# EasyEDA Pro project ProProject_keyboard_Tassel43_2024-03-30.epro, board Tassel43_Without_RGB
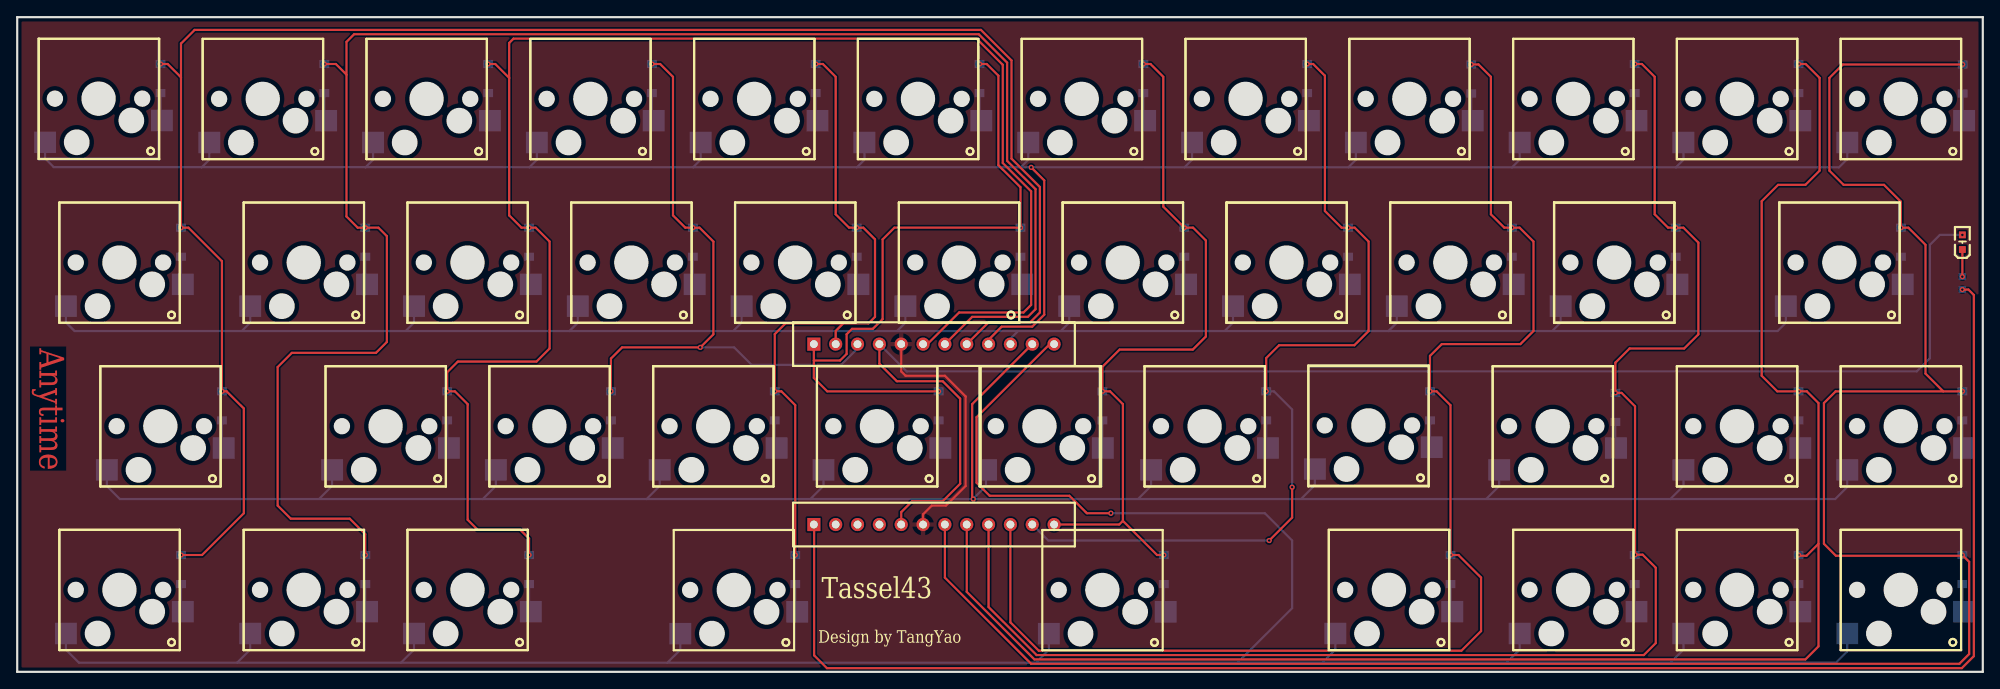
[diagram p3: board, top side]
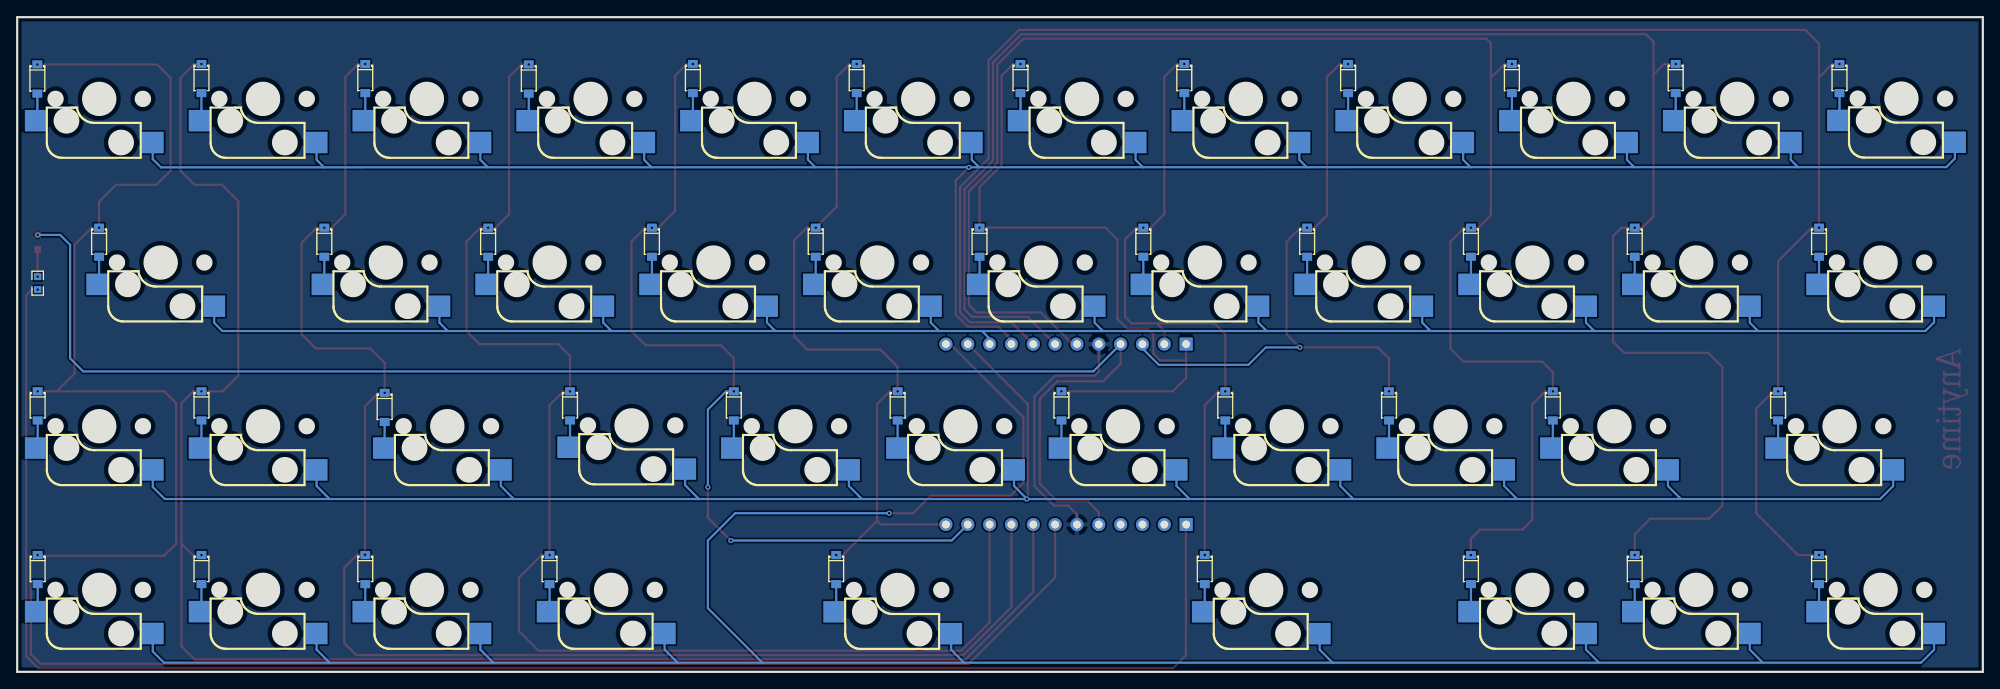
[diagram p4: board, bottom side, seen from below]

Outline 228.6 x 76.2 mm; copper layers: Top Layer, Bottom Layer. Coordinates in mm from the lower left corner of the outline.
Outline path: 0,76.2 228.6,76.2 228.6,0 0,0 0,76.2
Stack: Top Layer 0.035mm / Dielectric1 1.51mm FR4 er 4.5 / Bottom Layer 0.035mm

## Design rules (mm)
spacing Default (default): track to track 0.152, other pairs 0 to 0.152
track width Default (default): min 0.254, default 0.254, max 25.4
differential pair differentialPair (default): width min 0.127, default 0.254, max 2.54; gap min 0.152, default 0.152
via Default (default): diameter min 0.61, default 0.61, max 100.025; hole min 0.305, default 0.305, max 59.995
net GND uses gge53323
pour e199 uses gge53329
pour e490 uses gge53323

## Placement (name value [footprint] x y rotation side)
A  -  [凯华热插拨]  33.32 47.64 0 top
B  -  [凯华热插拨]  118.89 28.59 0 top
BACKSPACE  -  [凯华热插拨]  219.06 66.69 0 top
C  -  [凯华热插拨]  80.95 28.59 0 top
CAP  -  [凯华热插拨]  16.65 28.59 0 top
D  -  [凯华热插拨]  71.42 47.64 0 top
D14  1N4148W  [SOD-123_L2.8-W1.8-LS3.7-RD]  19.05 11.91 270 bottom
D35  1N4148W  [SOD-123_L2.8-W1.8-LS3.7-RD]  40.48 11.91 270 bottom
D41  1N4148W  [SOD-123_L2.8-W1.8-LS3.7-RD]  59.53 11.91 270 bottom
D43  1N4148W  [SOD-123_L2.8-W1.8-LS3.7-RD]  90.49 11.91 270 bottom
D45  1N4148W  [SOD-123_L2.8-W1.8-LS3.7-RD]  133.35 11.91 270 bottom
D49  1N4148W  [SOD-123_L2.8-W1.8-LS3.7-RD]  166.69 11.91 270 bottom
D50  1N4148W  [SOD-123_L2.8-W1.8-LS3.7-RD]  188.12 11.91 270 bottom
D51  1N4148W  [SOD-123_L2.8-W1.8-LS3.7-RD]  207.17 11.91 270 bottom
D52  1N4148W  [SOD-123_L2.8-W1.8-LS3.7-RD]  226.22 11.91 270 bottom
D53  1N4148W  [SOD-123_L2.8-W1.8-LS3.7-RD]  23.81 30.96 270 bottom
D54  1N4148W  [SOD-123_L2.8-W1.8-LS3.7-RD]  50 30.96 270 bottom
D55  1N4148W  [SOD-123_L2.8-W1.8-LS3.7-RD]  69.05 30.96 270 bottom
D56  1N4148W  [SOD-123_L2.8-W1.8-LS3.7-RD]  88.11 30.96 270 bottom
D57  1N4148W  [SOD-123_L2.8-W1.8-LS3.7-RD]  107.16 30.96 270 bottom
D58  1N4148W  [SOD-123_L2.8-W1.8-LS3.7-RD]  126.21 30.96 270 bottom
D59  1N4148W  [SOD-123_L2.8-W1.8-LS3.7-RD]  145.26 30.96 270 bottom
D60  1N4148W  [SOD-123_L2.8-W1.8-LS3.7-RD]  164.31 30.96 270 bottom
D61  1N4148W  [SOD-123_L2.8-W1.8-LS3.7-RD]  185.87 30.78 270 bottom
D62  1N4148W  [SOD-123_L2.8-W1.8-LS3.7-RD]  207.17 30.96 270 bottom
D63  1N4148W  [SOD-123_L2.8-W1.8-LS3.7-RD]  226.22 30.96 270 bottom
D64  1N4148W  [SOD-123_L2.8-W1.8-LS3.7-RD]  19.05 50.01 270 bottom
D65  1N4148W  [SOD-123_L2.8-W1.8-LS3.7-RD]  40.48 50.01 270 bottom
D66  1N4148W  [SOD-123_L2.8-W1.8-LS3.7-RD]  59.53 50.01 270 bottom
D68  1N4148W  [SOD-123_L2.8-W1.8-LS3.7-RD]  78.58 50.01 270 bottom
D69  1N4148W  [SOD-123_L2.8-W1.8-LS3.7-RD]  97.63 50.01 270 bottom
D70  1N4148W  [SOD-123_L2.8-W1.8-LS3.7-RD]  116.68 50.01 270 bottom
D71  1N4148W  [SOD-123_L2.8-W1.8-LS3.7-RD]  135.73 50.01 270 bottom
D72  1N4148W  [SOD-123_L2.8-W1.8-LS3.7-RD]  154.78 50.01 270 bottom
D73  1N4148W  [SOD-123_L2.8-W1.8-LS3.7-RD]  173.83 50.01 270 bottom
D74  1N4148W  [SOD-123_L2.8-W1.8-LS3.7-RD]  192.88 50.01 270 bottom
D75  1N4148W  [SOD-123_L2.8-W1.8-LS3.7-RD]  219.08 50.01 270 bottom
D76  1N4148W  [SOD-123_L2.8-W1.8-LS3.7-RD]  226.25 69.01 270 bottom
D77  1N4148W  [SOD-123_L2.8-W1.8-LS3.7-RD]  207.17 69.06 270 bottom
D78  1N4148W  [SOD-123_L2.8-W1.8-LS3.7-RD]  188.12 69.06 270 bottom
D79  1N4148W  [SOD-123_L2.8-W1.8-LS3.7-RD]  169.1 69.01 270 bottom
D80  1N4148W  [SOD-123_L2.8-W1.8-LS3.7-RD]  150.02 69.06 270 bottom
D81  1N4148W  [SOD-123_L2.8-W1.8-LS3.7-RD]  130.97 69.06 270 bottom
D82  1N4148W  [SOD-123_L2.8-W1.8-LS3.7-RD]  111.92 69.06 270 bottom
D83  1N4148W  [SOD-123_L2.8-W1.8-LS3.7-RD]  92.87 69.06 270 bottom
D84  1N4148W  [SOD-123_L2.8-W1.8-LS3.7-RD]  73.82 69.06 270 bottom
D85  1N4148W  [SOD-123_L2.8-W1.8-LS3.7-RD]  54.77 69.06 270 bottom
D86  1N4148W  [SOD-123_L2.8-W1.8-LS3.7-RD]  35.72 69.06 270 bottom
D87  1N4148W  [SOD-123_L2.8-W1.8-LS3.7-RD]  16.67 69.06 270 bottom
DEL  -  [凯华热插拨]  219.06 28.59 0 top
E  -  [凯华热插拨]  66.66 66.69 0 top
ENTER  -  [凯华热插拨]  211.91 47.64 0 top
ESC  -  [凯华热插拨]  9.47 66.72 0 top
F  -  [凯华热插拨]  90.47 47.64 0 top
G  -  [凯华热插拨]  109.52 47.64 0 top
H  -  [凯华热插拨]  128.57 47.64 0 top
I  -  [凯华热插拨]  161.91 66.69 0 top
J  -  [凯华热插拨]  147.62 47.64 0 top
K  -  [凯华热插拨]  166.67 47.64 0 top
L  -  [凯华热插拨]  185.72 47.64 0 top
LCTRL  -  [凯华热插拨]  11.89 9.54 0 top
LED1  TJ-S1608SW6TGLC2R-A5  [LED0603-R-RD_RED]  226.22 50.01 90 top
LGUI  -  [凯华热插拨]  33.32 9.54 0 top
LGUI1  -  [凯华热插拨]  52.37 9.54 0 top
LGUI2  -  [凯华热插拨]  159.53 9.54 0 top
LGUI3  -  [凯华热插拨]  180.96 9.54 0 top
LGUI4  -  [凯华热插拨]  200.01 9.54 0 top
LGUI5  -  [凯华热插拨]  219.06 9.54 0 top
LGUI6  -  [凯华热插拨]  83.34 9.52 0 top
LGUI7  -  [凯华热插拨]  126.21 9.52 0 top
M  -  [凯华热插拨]  157.15 28.68 0 top
N  -  [凯华热插拨]  138.1 28.59 0 top
O  -  [凯华热插拨]  180.96 66.69 0 top
P  -  [凯华热插拨]  200.01 66.69 0 top
Q  -  [凯华热插拨]  28.56 66.69 0 top
R  -  [凯华热插拨]  85.71 66.69 0 top
R7  1kΩ  [R0603]  226.22 45.24 90 bottom
S  -  [凯华热插拨]  52.37 47.64 0 top
T  -  [凯华热插拨]  104.76 66.69 0 top
TAB  -  [凯华热插拨]  11.89 47.64 0 top
TO  -  [凯华热插拨]  178.58 28.59 0 top
U  -  [凯华热插拨]  142.86 66.69 0 top
U5  -  [1X12排针]  95.19 14.6 90 top
U6  -  [1X12排针]  95.19 35.6 90 top
UP  -  [凯华热插拨]  200.01 28.59 0 top
V  -  [凯华热插拨]  100 28.59 0 top
W  -  [凯华热插拨]  47.61 66.69 0 top
X  -  [凯华热插拨]  61.9 28.59 0 top
Y  -  [凯华热插拨]  123.81 66.69 0 top
Z  -  [凯华热插拨]  42.85 28.59 0 top

## Footprints (pads in the part's own frame, mm; a bottom-side part is the same pattern mirrored in y, then rotated)
1X12排针
  rect 1.524x1.524 hole 0.914: 1(2.54,2.54)
  round 1.524 hole 0.914: 2(2.541,0) 3(2.541,-2.54) 4(2.541,-5.08) 5(2.541,-7.62) 6(2.541,-10.16) 7(2.541,-12.7) 8(2.541,-15.24) 9(2.541,-17.78) 10(2.541,-20.32) 11(2.541,-22.86) 12(2.541,-25.4)
LED0603-R-RD_RED
  rect 0.8x0.8 smd: 1(0.851,0) 2(-0.851,0)
R0603
  rect 0.806x0.864 smd: 1(-0.753,0) 2(0.753,0)
SOD-123_L2.8-W1.8-LS3.7-RD
  rect 0.95x1.15 smd: 1(-1.692,0) 2(1.692,0)
凯华热插拨
  rect 2.55x2.5 smd far side: K1(-6.223,-5.08) K2(7.366,-2.54)

## Nets
GND: U5.6 U6.5
V1_4: D57.2 V.K2
VCC: LED1.1 U5.5 U6.4
A1_4: A.K2 D65.2
B1_4: B.K2 D58.2
C9_4: C.K2 D56.2
CAPLED: R7.1 U5.1
CAPS1_4: D49.2 LGUI2.K2
COL0: D14.1 D53.1 D64.1 D87.1 U6.8
COL1: D35.1 D65.1 D86.1 U6.7
COL2: D41.1 D54.1 D66.1 D85.1 U6.6
COL3: D55.1 D68.1 D84.1 U6.3
COL4: D43.1 D56.1 D69.1 D83.1 U6.2
COL5: D57.1 D70.1 D82.1 U6.1
COL6: D45.1 D58.1 D71.1 D81.1 U5.12
COL7: D59.1 D72.1 D80.1 U5.11
COL8: D49.1 D60.1 D73.1 D79.1 U5.10
COL9: D50.1 D61.1 D74.1 D78.1 U5.9
COL10: D51.1 D62.1 D77.1 U5.8
COL11: D52.1 D63.1 D75.1 D76.1 U5.7
D14_2: D14.2 LCTRL.K2
D53_2: CAP.K2 D53.2
D64_2: D64.2 TAB.K2
D67_4: D.K2 D68.2
D76_2: BACKSPACE.K2 D76.2
D77_2: D77.2 P.K2
D78_2: D78.2 O.K2
D79_2: D79.2 I.K2
D80_2: D80.2 U.K2
D81_2: D81.2 Y.K2
D82_2: D82.2 T.K2
D83_2: D83.2 R.K2
D84_2: D84.2 E.K2
D85_2: D85.2 W.K2
D86_2: D86.2 Q.K2
D+: U5.3
D-: U5.2
DEL1_4: D63.2 DEL.K2
DOWN1_4: D51.2 LGUI4.K2
ENTER1_4: D75.2 ENTER.K2
ESC1_4: D87.2 ESC.K2
F1_4: D69.2 F.K2
G1_4: D70.2 G.K2
H1_4: D71.2 H.K2
J2_4: D72.2 J.K2
K1_4: D73.2 K.K2
L1_4: D74.2 L.K2
LALT1_4: D41.2 LGUI1.K2
LEFT1_4: D50.2 LGUI3.K2
LGUI1_4: D35.2 LGUI.K2
M1_4: D60.2 M.K2
N1_4: D59.2 N.K2
R7_2: LED1.2 R7.2
RGB: U5.4
RIGHT1_4: D52.2 LGUI5.K2
ROW0: BACKSPACE.K1 E.K1 ESC.K1 I.K1 O.K1 P.K1 Q.K1 R.K1 T.K1 U.K1 U6.9 W.K1 Y.K1
ROW1: A.K1 D.K1 ENTER.K1 F.K1 G.K1 H.K1 J.K1 K.K1 L.K1 S.K1 TAB.K1 U6.10
ROW2: B.K1 C.K1 CAP.K1 DEL.K1 M.K1 N.K1 TO.K1 U6.11 UP.K1 V.K1 X.K1 Z.K1
ROW3: LCTRL.K1 LGUI.K1 LGUI1.K1 LGUI2.K1 LGUI3.K1 LGUI4.K1 LGUI5.K1 LGUI6.K1 LGUI7.K1 U6.12
RSHIFT1_4: D45.2 LGUI7.K2
S1_4: D66.2 S.K2
SPACE1_4: D43.2 LGUI6.K2
TO1_4: D61.2 TO.K2
UP1_4: D62.2 UP.K2
X2_4: D55.2 X.K2
Z1_4: D54.2 Z.K2

## Via types
v1: diameter 0.61, hole 0.305, Top Layer to Bottom Layer, 52 vias

## Routing (per net, layer and track width the routed paths; a pad name or vN(x,y) marks a point on that pad's centre or on a via; arc(x,y) is an arc through that point)
GND: length 29.8
  Top Layer w0.254: 102.81,38.14 102.81,34.97 103.32,34.46 107.89,34.46 110.3,32.05 110.3,21.63 108.02,19.35 106.37,19.35 105.35,18.33 105.35,17.14
V1_4: length 3.3
  Bottom Layer w0.254: V.K2 107.16,26.26 D57.2
VCC: length 174.5
  Top Layer w0.254: 102.81,17.14 102.81,18.59 104.08,19.86 107.64,19.86 109.67,21.89 109.67,31.79 107.64,33.83 102.3,33.83 100.27,35.86 100.27,38.14
  Bottom Layer w0.254: v1(226.22,50.86) 223.6,50.86 222.44,49.7 222.44,36.49 220.92,34.97 103.45,34.97 100.27,38.14
A1_4: length 3.3
  Bottom Layer w0.254: A.K2 40.48,45.31 D65.2
B1_4: length 3.2
  Bottom Layer w0.254: D58.2 126.21,26.1 B.K2
C9_4: length 3.3
  Bottom Layer w0.254: D56.2 88.11,26.26 C.K2
CAPLED: length 194.9
  Top Layer w0.254: 226.22,44.49 226.92,44.49 227.56,43.86 227.56,1.82 226.16,0.43 94.17,0.43 92.68,1.92 92.68,17.15
  vias: v1(226.22,44.49)
CAPS1_4: length 3.3
  Bottom Layer w0.254: LGUI2.K2 166.69,7.21 D49.2
COL0: length 210.3
  Top Layer w0.254: 110.43,38.14 112.97,40.68 117.8,40.68 118.94,41.83 118.94,56.43 115.64,59.73 115.64,71.16 112.08,74.72 20.64,74.72 19.05,73.13 19.05,69.2 ; 19.05,69.2 17.5,70.75 16.67,70.75 ; 19.05,69.2 v1(19.05,51.7) 19.91,51.7 23.81,47.8 23.81,32.65 24.36,32.65 26.36,30.65 26.36,18.46 21.5,13.6 19.05,13.6
  vias: v1(16.67,70.75) v1(19.05,13.6) v1(23.81,32.65)
COL1: length 206.3
  Top Layer w0.254: U6.7 111.07,41.32 117.54,41.32 118.43,42.21 118.43,56.18 115.13,59.48 115.13,70.91 111.83,74.21 39.18,74.21 38.29,73.33 38.29,69.51 ; 38.29,69.51 38.29,53 39.6,51.7 v1(40.48,51.7) 42.01,51.7 42.99,50.72 42.99,38.4 41.72,37.13 31.94,37.13 30.29,35.48 30.29,19.35 31.82,17.82 38.68,17.82 40.48,16.02 v1(40.48,13.6) ; 38.29,69.51 37.06,70.75 35.72,70.75
  vias: v1(35.72,70.75)
COL2: length 185.9
  Top Layer w0.254: v1(59.53,51.7) 60.3,51.7 61.92,50.08 61.92,37.64 60.39,36.11 51.25,36.11 50,34.87 v1(50,32.65) 50.9,32.65 52.39,31.16 52.39,17.7 53.53,16.55 58.49,16.55 59.53,15.51 v1(59.53,13.6) ; 57.22,69.13 57.22,73.2 57.72,73.7 111.57,73.7 114.62,70.66 114.62,59.23 117.92,55.92 117.92,42.72 117.03,41.83 109.54,41.83 105.86,38.14 105.35,38.14 ; 57.22,69.13 55.6,70.75 54.77,70.75 ; 57.22,69.13 57.22,53.13 58.64,51.7 59.53,51.7
  vias: v1(54.77,70.75)
COL3: length 73.3
  Top Layer w0.254: 69.05,32.65 69.05,36.47 70.35,37.76 v1(79.44,37.76) 80.97,39.29 80.97,50.08 79.35,51.7 77.7,51.7 76.27,53.13 76.27,69.26 74.78,70.75 73.82,70.75
  Bottom Layer w0.254: 97.73,38.14 97.73,37.64 95.83,35.73 85.41,35.73 83.38,37.76 v1(79.44,37.76)
  vias: v1(69.05,32.65) v1(73.82,70.75) v1(78.58,51.7)
COL4: length 76.2
  Top Layer w0.254: 92.87,70.75 93.7,70.75 95.19,69.26 95.19,53.26 96.75,51.7 v1(97.63,51.7) 98.4,51.7 99.76,50.34 99.76,41.32 99,40.56 89.35,40.56 88.11,39.32 88.11,32.65 88.88,32.65 90.49,31.04 90.49,13.6 ; U6.2 95.19,39.68 96.07,40.56
  vias: v1(88.11,32.65) v1(90.49,13.6) v1(92.87,70.75)
COL5: length 77.8
  Top Layer w0.254: 111.92,70.75 112.75,70.75 114.11,69.39 114.11,58.97 116.68,56.4 116.68,51.7 102.02,51.7 100.65,50.34 100.65,41.07 99.51,39.92 97.1,39.92 96.46,39.29 96.46,37 95.7,36.24 92.65,36.24 ; 92.65,38.14 92.65,34.21 94.21,32.65 107.16,32.65
  vias: v1(107.16,32.65) v1(111.92,70.75) v1(116.68,51.7)
COL6: length 83.3
  Top Layer w0.254: U5.12 128.17,17.14 128.59,17.57 ; 128.59,17.57 128.59,31.16 127.1,32.65 126.21,32.65 126.21,35.51 128.21,37.51 136.72,37.51 138.24,39.03 138.24,50.21 136.75,51.7 v1(135.73,51.7) 133.29,54.14 133.29,69.26 131.8,70.75 v1(130.97,70.75) ; 128.59,17.57 132.56,13.6 133.35,13.6
  vias: v1(126.21,32.65) v1(133.35,13.6)
COL7: length 101
  Top Layer w0.254: v1(145.61,15.28) 148.28,17.95 v1(148.28,21.49) ; 145.26,32.65 145.26,36.52 146.75,38.02 155.52,38.02 157.17,39.67 157.17,50.08 155.55,51.7 v1(154.78,51.7) 154.02,51.7 152.09,53.64 152.09,69.39 150.72,70.75 150.02,70.75
  Bottom Layer w0.254: v1(145.61,15.28) 119.91,15.28 U5.11 ; v1(148.28,21.49) 148.28,30.52 146.15,32.65 145.26,32.65
  vias: v1(145.26,32.65) v1(150.02,70.75)
COL8: length 152.7
  Top Layer w0.254: 115.51,17.14 115.51,5.76 118.81,2.46 167.96,2.46 170.25,4.74 170.25,10.97 167.62,13.6 166.69,13.6 166.69,31.03 165.08,32.65 164.31,32.65 164.31,36.78 165.68,38.14 174.82,38.14 176.34,39.67 176.34,50.08 174.73,51.7 172.95,51.7 171.39,53.26 171.39,69.26 169.95,70.7 v1(169.1,70.7)
  vias: v1(164.31,32.65) v1(166.69,13.6) v1(173.83,51.7)
COL9: length 172.7
  Top Layer w0.254: 112.97,17.14 112.97,7.54 118.56,1.95 189.17,1.95 190.57,3.35 190.57,12.11 189.04,13.63 v1(188.15,13.63) 188.15,30.91 186.59,32.47 v1(185.87,32.47) ; 185.87,32.47 185.87,35.99 187.52,37.64 193.87,37.64 195.52,39.29 195.52,49.96 193.78,51.7 192,51.7 190.44,53.26 190.44,69.26 188.95,70.75 188.12,70.75
  vias: v1(188.12,70.75) v1(192.88,51.7)
COL10: length 192.4
  Top Layer w0.254: v1(207.17,13.6) 207.26,13.51 208.09,13.51 209.49,14.9 ; 209.49,14.9 209.49,31.29 208.13,32.65 v1(207.17,32.65) ; 209.49,14.9 209.49,2.97 207.97,1.44 118.3,1.44 110.43,9.31 110.43,17.14 ; 207.17,32.65 204.7,32.65 202.89,34.46 202.89,54.78 204.79,56.69 207.97,56.69 209.62,58.34 209.62,69.13 208,70.75 207.17,70.75
  vias: v1(207.17,70.75)
COL11: length 252.9
  Top Layer w0.254: v1(226.22,13.6) 226.13,13.51 211.52,13.51 210.13,14.9 210.13,31.29 211.49,32.65 224,32.65 ; 224,32.65 226.22,32.65 ; 224,32.65 221.94,34.72 221.94,49.7 219.94,51.7 v1(219.08,51.7) 219.08,54.72 217.11,56.69 212.41,56.69 210.76,58.34 210.76,69.13 212.32,70.7 v1(226.25,70.7) ; 107.89,17.14 107.89,10.97 117.92,0.93 225.87,0.93 227.02,2.08 227.02,12.8 226.22,13.6
  vias: v1(226.22,32.65)
D14_2: length 3.3
  Bottom Layer w0.254: D14.2 19.05,7.21 LCTRL.K2
D53_2: length 3.3
  Bottom Layer w0.254: CAP.K2 23.81,26.26 D53.2
D64_2: length 3.3
  Bottom Layer w0.254: D64.2 19.05,45.31 TAB.K2
D67_4: length 3.3
  Bottom Layer w0.254: D.K2 78.58,45.31 D68.2
D76_2: length 3.2
  Bottom Layer w0.254: BACKSPACE.K2 226.25,64.32 D76.2
D77_2: length 3.3
  Bottom Layer w0.254: 207.38,64.15 207.17,64.36 D77.2
D78_2: length 3.3
  Bottom Layer w0.254: D78.2 188.12,64.36 O.K2
D79_2: length 3.2
  Bottom Layer w0.254: D79.2 169.1,64.32 I.K2
D80_2: length 3.3
  Bottom Layer w0.254: U.K2 150.02,64.36 D80.2
D81_2: length 3.3
  Bottom Layer w0.254: D81.2 130.97,64.36 Y.K2
D82_2: length 3.3
  Bottom Layer w0.254: T.K2 111.92,64.36 D82.2
D83_2: length 3.3
  Bottom Layer w0.254: D83.2 92.87,64.36 R.K2
D84_2: length 3.3
  Bottom Layer w0.254: E.K2 73.82,64.36 D84.2
D85_2: length 3.3
  Bottom Layer w0.254: W.K2 54.77,64.36 D85.2
D86_2: length 3.3
  Bottom Layer w0.254: D86.2 35.72,64.36 Q.K2
DEL1_4: length 3.3
  Bottom Layer w0.254: D63.2 226.22,26.25 DEL.K2
DOWN1_4: length 3.3
  Bottom Layer w0.254: D51.2 207.17,7.21 LGUI4.K2
ENTER1_4: length 3.3
  Bottom Layer w0.254: ENTER.K2 219.08,45.3 D75.2
ESC1_4: length 3.3
  Bottom Layer w0.254: D87.2 16.67,64.34 ESC.K2
F1_4: length 3.3
  Bottom Layer w0.254: F.K2 97.63,45.31 D69.2
G1_4: length 3.3
  Bottom Layer w0.254: G.K2 116.68,45.31 D70.2
H1_4: length 3.3
  Bottom Layer w0.254: H.K2 135.73,45.31 D71.2
J2_4: length 3.3
  Bottom Layer w0.254: J.K2 154.78,45.31 D72.2
K1_4: length 3.3
  Bottom Layer w0.254: K.K2 173.83,45.31 D73.2
L1_4: length 3.3
  Bottom Layer w0.254: L.K2 192.88,45.31 D74.2
LALT1_4: length 3.3
  Bottom Layer w0.254: LGUI1.K2 59.53,7.21 D41.2
LEFT1_4: length 3.3
  Bottom Layer w0.254: D50.2 188.12,7.21 LGUI3.K2
LGUI1_4: length 3.3
  Bottom Layer w0.254: D35.2 40.48,7.21 LGUI.K2
M1_4: length 3.2
  Bottom Layer w0.254: M.K2 164.31,26.35 D60.2
N1_4: length 3.3
  Bottom Layer w0.254: D59.2 145.26,26.26 N.K2
R7_2: length 3.2
  Top Layer w0.254: v1(226.22,46) 226.22,49.19
RIGHT1_4: length 3.3
  Bottom Layer w0.254: LGUI5.K2 226.22,7.21 D52.2
ROW0: length 272.7
  Top Layer w0.254: 112.97,38.14 112.97,38.65 114.49,40.18 118.05,40.18 119.45,41.57 119.45,57.19 v1(117.92,58.72)
  Bottom Layer w0.254: 97.66,58.72 98.53,59.6 T.K1 ; 212.84,59.68 211.88,58.72 4.25,58.75 3.24,59.75 ESC.K1 ; 212.84,59.68 BACKSPACE.K1 ; O.K1 174.74,59.6 173.86,58.72 ; Y.K1 117.59,59.6 116.71,58.72 ; R.K1 79.49,59.6 78.61,58.72 ; I.K1 155.69,59.6 154.81,58.72 ; U.K1 136.64,59.6 135.76,58.72 ; 192.91,58.72 193.79,59.6 P.K1 ; Q.K1 22.34,59.6 21.46,58.72 ; 59.56,58.72 60.44,59.6 E.K1 ; W.K1 41.39,59.6 40.51,58.72
ROW1: length 236.2
  Bottom Layer w0.254: F.K1 84.25,40.64 83.28,39.67 ; 122.35,42.56 122.35,40.64 121.38,39.67 ; D.K1 65.2,40.64 64.23,39.67 ; 45.18,39.67 46.15,40.64 S.K1 ; 178.53,39.67 179.5,40.64 L.K1 ; 116.4,39.67 115.51,38.78 U6.10 ; 159.48,39.67 160.45,40.64 K.K1 ; J.K1 141.4,40.64 140.43,39.67 ; A.K1 27.1,40.64 26.13,39.67 ; 102.33,39.67 103.3,40.64 G.K1 ; TAB.K1 5.67,40.67 6.67,39.67 204.73,39.67 205.69,40.63 ENTER.K1
ROW2: length 264.8
  Top Layer w0.254: v1(111.19,20.11) 111.07,20.24 111.07,31.16 118.05,38.14
  Bottom Layer w0.254: 54.15,20.11 55.67,21.63 55.67,23.51 ; 111.15,20.11 112.67,21.63 B.K1 ; 73.2,20.11 74.72,21.63 C.K1 ; 130.35,20.11 131.87,21.63 N.K1 ; 92.25,20.11 93.77,21.63 V.K1 ; DEL.K1 212.83,21.51 211.43,20.11 11.94,20.11 10.43,21.62 CAP.K1 ; 149.4,20.2 150.92,21.73 M.K1 ; 35.1,20.11 36.62,21.63 Z.K1 ; 170.83,20.11 172.35,21.63 172.35,23.51 ; UP.K1 193.78,21.63 192.26,20.11
ROW3: length 317
  Top Layer w0.254: v1(127.19,18.46) 124.4,18.46 122.37,20.49 113.1,20.49 111.57,22.02 111.57,29.64 120.08,38.14 120.59,38.14
  Bottom Layer w0.254: 174.73,4.46 174.73,2.58 173.21,1.06 ; LGUI.K1 27.1,2.58 25.57,1.06 ; LCTRL.K1 5.67,2.57 7.18,1.06 211.52,1.06 212.84,2.37 LGUI5.K1 ; LGUI1.K1 46.15,2.58 44.62,1.06 ; 141.93,1.06 148.28,7.41 148.28,15.28 145.1,18.46 v1(127.19,18.46) ; LGUI7.K1 119.98,2.57 118.46,1.04 ; 193.78,4.46 193.78,2.58 192.26,1.06 ; 75.59,1.04 77.12,2.57 77.12,4.45 ; 151.78,1.06 153.3,2.58 LGUI2.K1
RSHIFT1_4: length 3.3
  Bottom Layer w0.254: LGUI7.K2 133.35,7.21 D45.2
S1_4: length 3.3
  Bottom Layer w0.254: S.K2 59.53,45.31 D66.2
SPACE1_4: length 3.3
  Bottom Layer w0.254: LGUI6.K2 90.49,7.21 D43.2
TO1_4: length 3.1
  Bottom Layer w0.254: TO.K2 185.87,26.13 D61.2
UP1_4: length 3.3
  Bottom Layer w0.254: UP.K2 207.17,26.25 D62.2
X2_4: length 3.3
  Bottom Layer w0.254: D55.2 69.05,26.26 X.K2
Z1_4: length 3.3
  Bottom Layer w0.254: D54.2 50,26.26 Z.K2

## Copper pours and planes (outline as drawn; the poured copper is in the pictures)
GND on Top Layer: -2.85,75.86 -0.31,78.4 228.29,78.4 230.83,75.86 230.83,-0.34 228.29,-2.88 -0.31,-2.88 -2.85,-0.34
GND on Bottom Layer: -0.31,80.94 -5.39,75.86 -5.39,-0.34 -0.31,-5.42 228.29,-5.42 233.37,-0.34 233.37,75.86 228.29,80.94

## Text on the board
Top Layer: Anytime
Top Solder Mask Layer: Design by TangYao | Tassel43
Top Silkscreen Layer: Design by TangYao | Tassel43
